# Altium schematic sheet wisp-6-main.SchDoc: WISP-6.0
size B; SheetNumber: 1; SheetTotal: 4
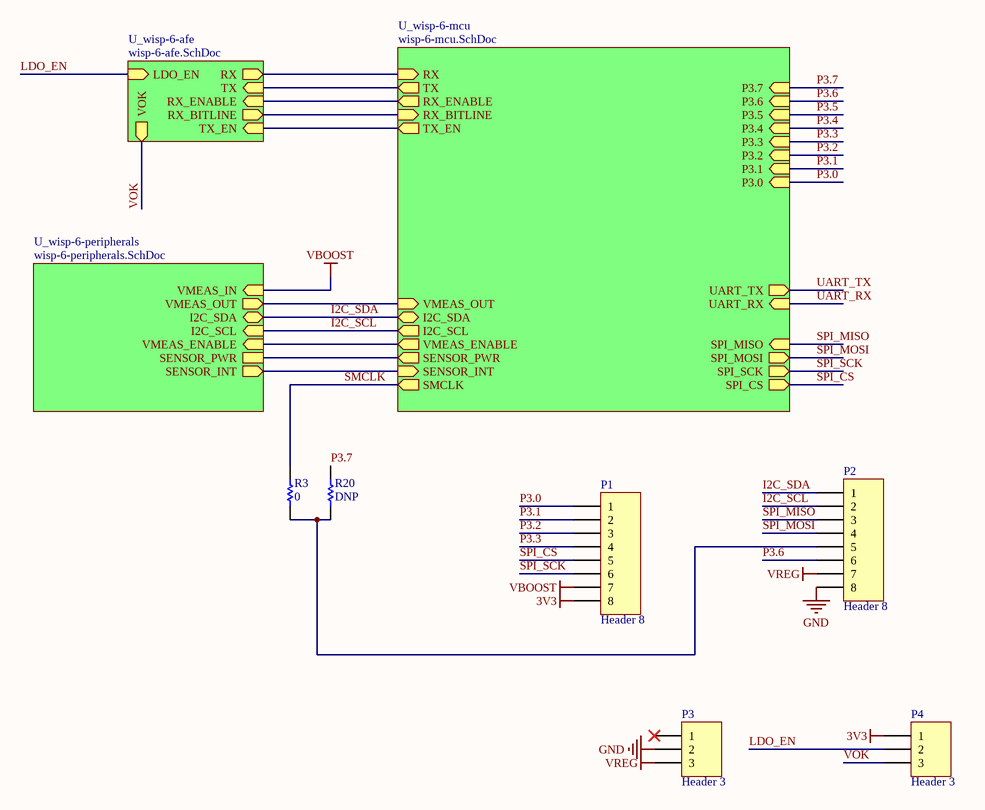
[diagram p0: wisp-6-main.SchDoc]

## Parts
P1  Header 8  [HDR1X8]
P2  Header 8  [HDR1X8]
P3  Header 3  [HDR1X3]
P4  Header 3  [HDR1X3]
R3  value 0  [0402]  (hidden comment: Res)
R20  value DNP  [0402]  (hidden comment: Res)

## Sub-sheets
U_wisp-6-afe = wisp-6-afe.SchDoc: TX (in), RX_ENABLE (in), RX (out), RX_BITLINE (out), TX_EN (in), VOK (out), LDO_EN (in)
U_wisp-6-mcu = wisp-6-mcu.SchDoc: RX (in), TX (out), RX_ENABLE (out), VMEAS_ENABLE (out), I2C_SCL (out), I2C_SDA (bidir), VMEAS_OUT (in), P3.0 (in), P3.1 (in), P3.2 (in), P3.3 (in), P3.4 (in), P3.5 (in), P3.6 (in), P3.7 (in), SPI_CS (out), RX_BITLINE (in), UART_RX (in), UART_TX (out), SPI_SCK (out), SENSOR_PWR (out), SENSOR_INT (in), TX_EN (out), SMCLK (out), SPI_MISO (in), SPI_MOSI (out)
U_wisp-6-peripherals = wisp-6-peripherals.SchDoc: VMEAS_IN (in), VMEAS_OUT (out), VMEAS_ENABLE (in), I2C_SCL (in), I2C_SDA (bidir), SENSOR_INT (out), SENSOR_PWR

## Nets
3V3: P1.8 P4.1
GND: P2.8 P3.2
VBOOST: P1.7 ; sheet U_wisp-6-peripherals/VMEAS_IN
VREG: P2.7 P3.3
I2C_SCL: P2.2 ; sheet U_wisp-6-mcu/I2C_SCL, sheet U_wisp-6-peripherals/I2C_SCL
I2C_SDA: P2.1 ; sheet U_wisp-6-mcu/I2C_SDA, sheet U_wisp-6-peripherals/I2C_SDA
LDO_EN: P4.2 ; sheet U_wisp-6-afe/LDO_EN
P3.0: P1.1 ; sheet U_wisp-6-mcu/P3.0
P3.1: P1.2 ; sheet U_wisp-6-mcu/P3.1
P3.2: P1.3 ; sheet U_wisp-6-mcu/P3.2
P3.3: P1.4 ; sheet U_wisp-6-mcu/P3.3
P3.4: sheet U_wisp-6-mcu/P3.4
P3.5: sheet U_wisp-6-mcu/P3.5
P3.6: P2.6 ; sheet U_wisp-6-mcu/P3.6
P3.7: R20.2 ; sheet U_wisp-6-mcu/P3.7
SMCLK: R3.2 ; sheet U_wisp-6-mcu/SMCLK
SPI_CS: P1.5 ; sheet U_wisp-6-mcu/SPI_CS
SPI_MISO: P2.3 ; sheet U_wisp-6-mcu/SPI_MISO
SPI_MOSI: P2.4 ; sheet U_wisp-6-mcu/SPI_MOSI
SPI_SCK: P1.6 ; sheet U_wisp-6-mcu/SPI_SCK
UART_RX: sheet U_wisp-6-mcu/UART_RX
UART_TX: sheet U_wisp-6-mcu/UART_TX
VOK: P4.3 ; sheet U_wisp-6-afe/VOK
NetP2_5: P2.5 R3.1 R20.1
(unnamed): sheet U_wisp-6-mcu/RX, sheet U_wisp-6-afe/RX
(unnamed): sheet U_wisp-6-mcu/TX, sheet U_wisp-6-afe/TX
(unnamed): sheet U_wisp-6-mcu/RX_ENABLE, sheet U_wisp-6-afe/RX_ENABLE
(unnamed): sheet U_wisp-6-mcu/VMEAS_ENABLE, sheet U_wisp-6-peripherals/VMEAS_ENABLE
(unnamed): sheet U_wisp-6-mcu/VMEAS_OUT, sheet U_wisp-6-peripherals/VMEAS_OUT
(unnamed): sheet U_wisp-6-mcu/RX_BITLINE, sheet U_wisp-6-afe/RX_BITLINE
(unnamed): sheet U_wisp-6-mcu/SENSOR_PWR, sheet U_wisp-6-peripherals/SENSOR_PWR
(unnamed): sheet U_wisp-6-mcu/SENSOR_INT, sheet U_wisp-6-peripherals/SENSOR_INT
(unnamed): sheet U_wisp-6-mcu/TX_EN, sheet U_wisp-6-afe/TX_EN

Not connected (* = marked no-connect by the designer): P3 1*

## Library data of the parts
P1 P2 = Header 8: Header, 8-Pin; LatestRevisionDate: 17-Jul-2002; LatestRevisionNote: Re-released for DXP Platform.; Publisher: Altium Limited
P3 P4 = Header 3: Header, 3-Pin; LatestRevisionDate: 17-Jul-2002; LatestRevisionNote: Re-released for DXP Platform.; Publisher: Altium Limited
R3 R20 = Res: Chip Resistor (Surface Mount); Manufacturer: Generic Chip Res (TBD); Manufacturer Part Number: *; Digi-Key Part Number: *; Rating: *; Note: *